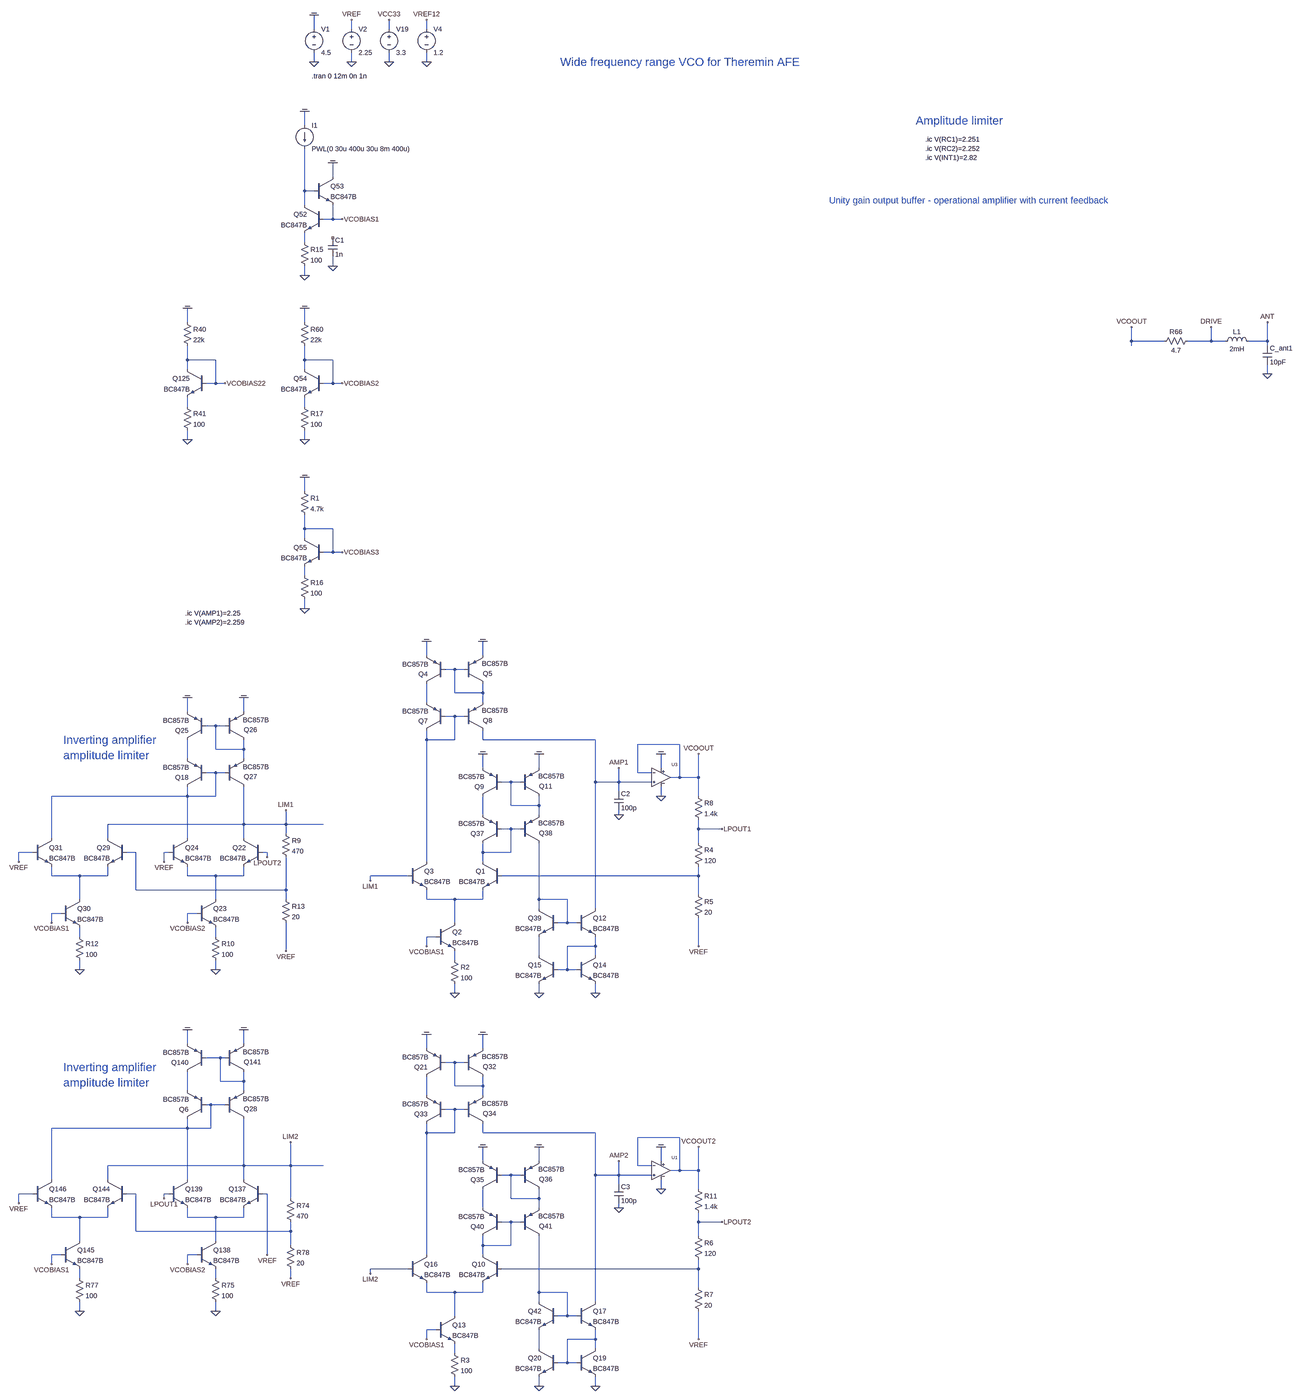
[diagram p0: schematic vco_sine_bjt_v05.asc, whole sheet]
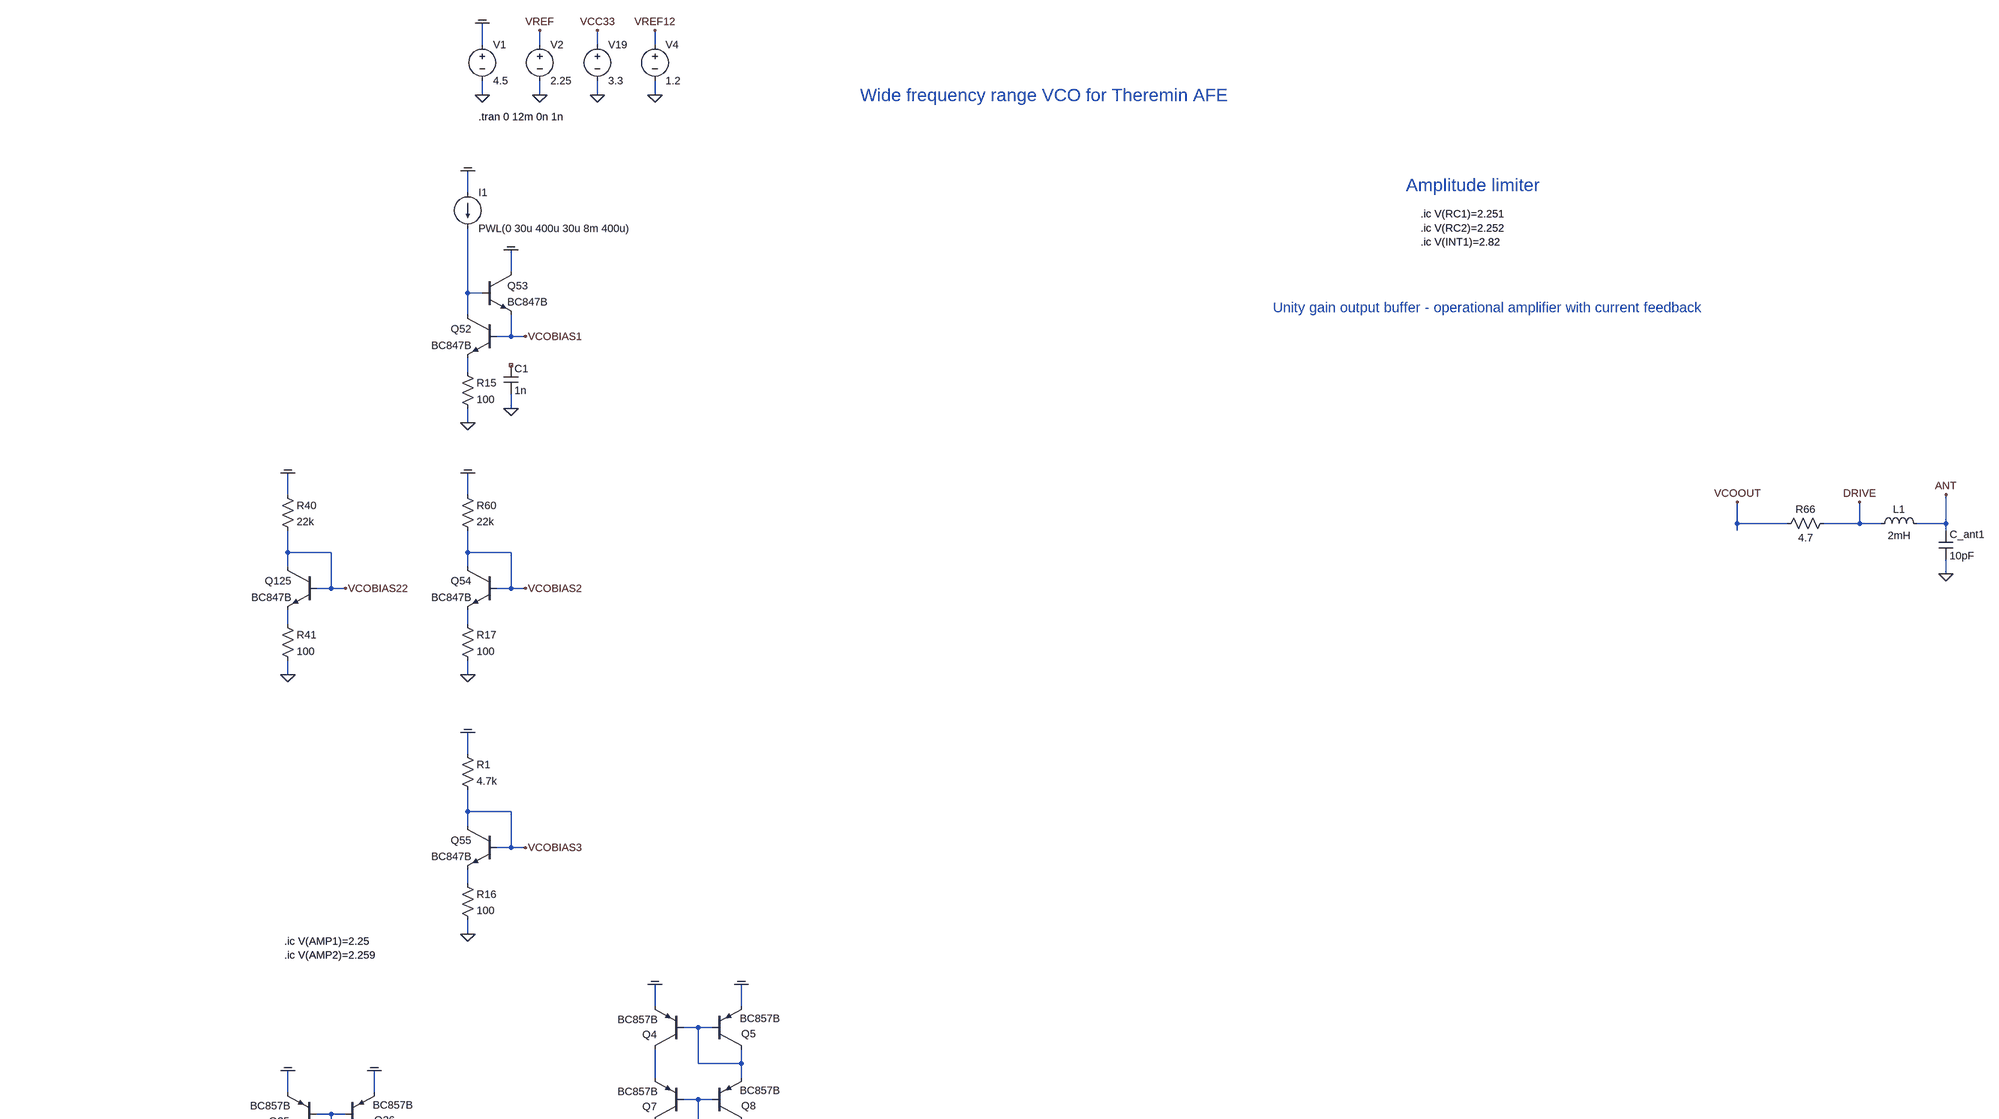
[diagram p1: schematic vco_sine_bjt_v05.asc, part, row 1 of 2, column 1 of 1]
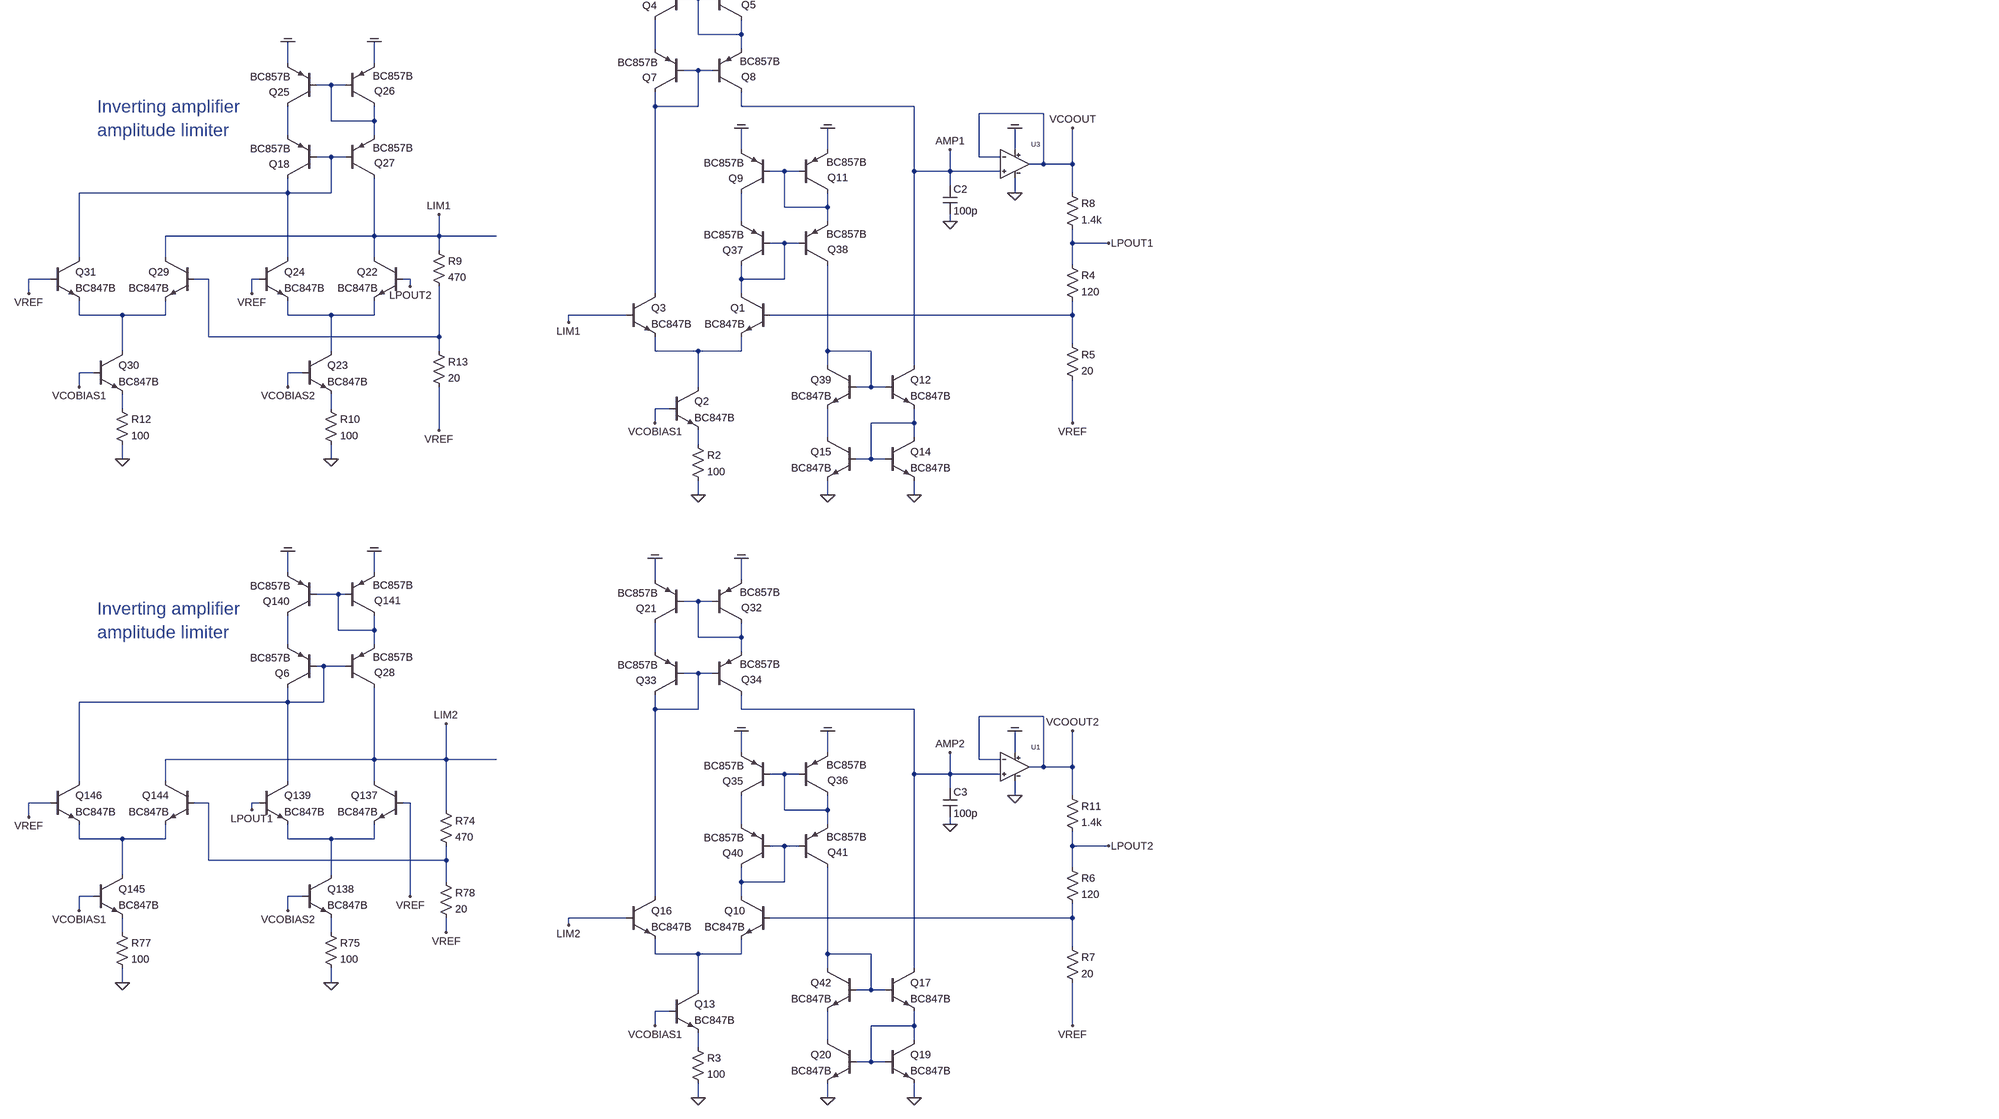
[diagram p2: schematic vco_sine_bjt_v05.asc, part, row 2 of 2, column 1 of 1]
vco_sine_bjt_v05.asc, the LTspice schematic file:
Version 4
SHEET 1 13504 19328
WIRE -432 13600 -432 13552
WIRE -304 13600 -304 13568
WIRE -176 13600 -176 13568
WIRE -48 13600 -48 13568
WIRE -432 13712 -432 13680
WIRE -304 13712 -304 13680
WIRE -176 13712 -176 13680
WIRE -48 13712 -48 13680
WIRE -464 14000 -464 13952
WIRE -368 14176 -368 14128
WIRE -464 14224 -464 14080
WIRE -432 14224 -464 14224
WIRE -464 14272 -464 14224
WIRE -368 14320 -368 14272
WIRE -368 14320 -400 14320
WIRE -336 14320 -368 14320
WIRE -464 14400 -464 14368
WIRE -368 14480 -368 14448
WIRE -464 14512 -464 14480
WIRE -864 14672 -864 14624
WIRE -464 14672 -464 14624
WIRE 3536 14736 3536 14688
WIRE 3648 14736 3536 14736
WIRE 3808 14736 3808 14688
WIRE 3808 14736 3728 14736
WIRE 3856 14736 3808 14736
WIRE 4000 14736 4000 14672
WIRE 4000 14736 3936 14736
WIRE 3536 14752 3536 14736
WIRE 4000 14752 4000 14736
WIRE -864 14800 -864 14752
WIRE -768 14800 -864 14800
WIRE -464 14800 -464 14752
WIRE -368 14800 -464 14800
WIRE -864 14832 -864 14800
WIRE -464 14832 -464 14800
WIRE 4000 14848 4000 14816
WIRE -768 14880 -768 14800
WIRE -768 14880 -800 14880
WIRE -736 14880 -768 14880
WIRE -368 14880 -368 14800
WIRE -368 14880 -400 14880
WIRE -336 14880 -368 14880
WIRE -864 14960 -864 14928
WIRE -464 14960 -464 14928
WIRE -864 15072 -864 15040
WIRE -464 15072 -464 15040
WIRE -464 15280 -464 15232
WIRE -464 15408 -464 15360
WIRE -368 15408 -464 15408
WIRE -464 15440 -464 15408
WIRE -368 15488 -368 15408
WIRE -368 15488 -400 15488
WIRE -336 15488 -368 15488
WIRE -464 15568 -464 15536
WIRE -464 15680 -464 15648
WIRE -48 15840 -48 15792
WIRE 144 15840 144 15792
WIRE 48 15888 16 15888
WIRE 80 15888 48 15888
WIRE 48 15968 48 15888
WIRE 144 15968 144 15936
WIRE 144 15968 48 15968
WIRE -48 16000 -48 15936
WIRE 144 16000 144 15968
WIRE -864 16032 -864 15984
WIRE -672 16032 -672 15984
WIRE 48 16048 16 16048
WIRE 80 16048 48 16048
WIRE -768 16080 -800 16080
WIRE -736 16080 -768 16080
WIRE -48 16128 -48 16096
WIRE 48 16128 48 16048
WIRE 48 16128 -48 16128
WIRE 144 16128 144 16096
WIRE 528 16128 144 16128
WIRE 816 16144 672 16144
WIRE -768 16160 -768 16080
WIRE -672 16160 -672 16128
WIRE -672 16160 -768 16160
WIRE -864 16192 -864 16128
WIRE -672 16192 -672 16160
WIRE 144 16224 144 16176
WIRE 336 16224 336 16176
WIRE 752 16224 752 16176
WIRE -768 16240 -800 16240
WIRE -736 16240 -768 16240
WIRE 672 16240 672 16144
WIRE 720 16240 672 16240
WIRE 816 16256 816 16144
WIRE 816 16256 784 16256
WIRE 880 16256 880 16176
WIRE 880 16256 816 16256
WIRE 240 16272 208 16272
WIRE 272 16272 240 16272
WIRE 528 16272 528 16128
WIRE 608 16272 608 16224
WIRE 608 16272 528 16272
WIRE 720 16272 608 16272
WIRE 608 16304 608 16272
WIRE -864 16320 -864 16288
WIRE -864 16320 -1328 16320
WIRE -768 16320 -768 16240
WIRE -768 16320 -864 16320
WIRE 752 16320 752 16288
WIRE 880 16320 880 16256
WIRE 240 16352 240 16272
WIRE 336 16352 336 16320
WIRE 336 16352 240 16352
WIRE 144 16384 144 16320
WIRE 336 16384 336 16352
WIRE 608 16384 608 16368
WIRE -672 16416 -672 16288
WIRE -672 16416 -1136 16416
WIRE -528 16416 -528 16368
WIRE -528 16416 -672 16416
WIRE -400 16416 -528 16416
WIRE 240 16432 208 16432
WIRE 272 16432 240 16432
WIRE 880 16432 880 16400
WIRE 960 16432 880 16432
WIRE -528 16448 -528 16416
WIRE -1328 16464 -1328 16320
WIRE -1136 16464 -1136 16416
WIRE -864 16464 -864 16320
WIRE -672 16464 -672 16416
WIRE 880 16480 880 16432
WIRE -1392 16512 -1440 16512
WIRE -1040 16512 -1072 16512
WIRE -928 16512 -944 16512
WIRE -592 16512 -608 16512
WIRE 144 16512 144 16480
WIRE 240 16512 240 16432
WIRE 240 16512 144 16512
WIRE -592 16528 -592 16512
WIRE -1440 16544 -1440 16512
WIRE -944 16544 -944 16512
WIRE -48 16544 -48 16128
WIRE 144 16544 144 16512
WIRE -1328 16592 -1328 16560
WIRE -1232 16592 -1328 16592
WIRE -1136 16592 -1136 16560
WIRE -1136 16592 -1232 16592
WIRE -864 16592 -864 16560
WIRE -768 16592 -864 16592
WIRE -672 16592 -672 16560
WIRE -672 16592 -768 16592
WIRE -112 16592 -240 16592
WIRE 880 16592 880 16560
WIRE 880 16592 208 16592
WIRE -240 16608 -240 16592
WIRE -1040 16640 -1040 16512
WIRE -528 16640 -528 16528
WIRE -528 16640 -1040 16640
WIRE 880 16656 880 16592
WIRE -1232 16672 -1232 16592
WIRE -768 16672 -768 16592
WIRE -528 16672 -528 16640
WIRE -48 16672 -48 16640
WIRE 48 16672 -48 16672
WIRE 144 16672 144 16640
WIRE 144 16672 48 16672
WIRE 336 16672 336 16480
WIRE 432 16672 336 16672
WIRE 336 16704 336 16672
WIRE 528 16704 528 16272
WIRE -1296 16720 -1328 16720
WIRE -832 16720 -864 16720
WIRE -1328 16752 -1328 16720
WIRE -864 16752 -864 16720
WIRE 48 16752 48 16672
WIRE 432 16752 432 16672
WIRE 432 16752 400 16752
WIRE 464 16752 432 16752
WIRE -1232 16800 -1232 16768
WIRE -768 16800 -768 16768
WIRE -16 16800 -48 16800
WIRE -48 16832 -48 16800
WIRE 528 16832 528 16800
WIRE 528 16832 432 16832
WIRE 880 16832 880 16736
WIRE -528 16848 -528 16752
WIRE 336 16864 336 16800
WIRE 528 16864 528 16832
WIRE 48 16880 48 16848
WIRE -1232 16912 -1232 16880
WIRE -768 16912 -768 16880
WIRE 432 16912 432 16832
WIRE 432 16912 400 16912
WIRE 464 16912 432 16912
WIRE 48 16992 48 16960
WIRE 336 16992 336 16960
WIRE 528 16992 528 16960
WIRE -864 17248 -864 17200
WIRE -672 17248 -672 17200
WIRE -48 17264 -48 17216
WIRE 144 17264 144 17216
WIRE -752 17296 -800 17296
WIRE -736 17296 -752 17296
WIRE 48 17312 16 17312
WIRE 80 17312 48 17312
WIRE -752 17376 -752 17296
WIRE -672 17376 -672 17344
WIRE -672 17376 -752 17376
WIRE 48 17392 48 17312
WIRE 144 17392 144 17360
WIRE 144 17392 48 17392
WIRE -864 17408 -864 17344
WIRE -672 17408 -672 17376
WIRE -48 17424 -48 17360
WIRE 144 17424 144 17392
WIRE -784 17456 -800 17456
WIRE -736 17456 -784 17456
WIRE 48 17472 16 17472
WIRE 80 17472 48 17472
WIRE -864 17536 -864 17504
WIRE -864 17536 -1328 17536
WIRE -784 17536 -784 17456
WIRE -784 17536 -864 17536
WIRE -48 17552 -48 17520
WIRE 48 17552 48 17472
WIRE 48 17552 -48 17552
WIRE 144 17552 144 17520
WIRE 528 17552 144 17552
WIRE 816 17568 672 17568
WIRE 144 17648 144 17600
WIRE 336 17648 336 17600
WIRE 752 17648 752 17600
WIRE -672 17664 -672 17504
WIRE -672 17664 -1136 17664
WIRE -512 17664 -512 17584
WIRE -512 17664 -672 17664
WIRE -400 17664 -512 17664
WIRE 672 17664 672 17568
WIRE 720 17664 672 17664
WIRE 816 17680 816 17568
WIRE 816 17680 784 17680
WIRE 880 17680 880 17600
WIRE 880 17680 816 17680
WIRE 240 17696 208 17696
WIRE 272 17696 240 17696
WIRE 528 17696 528 17552
WIRE 608 17696 608 17648
WIRE 608 17696 528 17696
WIRE 720 17696 608 17696
WIRE -1328 17712 -1328 17536
WIRE -1136 17712 -1136 17664
WIRE -864 17712 -864 17536
WIRE -672 17712 -672 17664
WIRE 608 17728 608 17696
WIRE 752 17744 752 17712
WIRE 880 17744 880 17680
WIRE -1392 17760 -1440 17760
WIRE -1040 17760 -1072 17760
WIRE -928 17760 -944 17760
WIRE -592 17760 -608 17760
WIRE -944 17776 -944 17760
WIRE -512 17776 -512 17664
WIRE 240 17776 240 17696
WIRE 336 17776 336 17744
WIRE 336 17776 240 17776
WIRE -1440 17792 -1440 17760
WIRE 144 17808 144 17744
WIRE 336 17808 336 17776
WIRE 608 17808 608 17792
WIRE -1328 17840 -1328 17808
WIRE -1232 17840 -1328 17840
WIRE -1136 17840 -1136 17808
WIRE -1136 17840 -1232 17840
WIRE -864 17840 -864 17808
WIRE -768 17840 -864 17840
WIRE -672 17840 -672 17808
WIRE -672 17840 -768 17840
WIRE 240 17856 208 17856
WIRE 272 17856 240 17856
WIRE 880 17856 880 17824
WIRE 960 17856 880 17856
WIRE -1040 17888 -1040 17760
WIRE -512 17888 -512 17856
WIRE -512 17888 -1040 17888
WIRE 880 17904 880 17856
WIRE -1232 17920 -1232 17840
WIRE -768 17920 -768 17840
WIRE -512 17936 -512 17888
WIRE 144 17936 144 17904
WIRE 240 17936 240 17856
WIRE 240 17936 144 17936
WIRE -1296 17968 -1328 17968
WIRE -832 17968 -864 17968
WIRE -592 17968 -592 17760
WIRE -48 17968 -48 17552
WIRE 144 17968 144 17936
WIRE -1328 18000 -1328 17968
WIRE -864 18000 -864 17968
WIRE -112 18016 -240 18016
WIRE 880 18016 880 17984
WIRE 880 18016 208 18016
WIRE -240 18032 -240 18016
WIRE -1232 18048 -1232 18016
WIRE -768 18048 -768 18016
WIRE -512 18048 -512 18016
WIRE 880 18080 880 18016
WIRE -48 18096 -48 18064
WIRE 48 18096 -48 18096
WIRE 144 18096 144 18064
WIRE 144 18096 48 18096
WIRE 336 18096 336 17904
WIRE 432 18096 336 18096
WIRE 336 18128 336 18096
WIRE 528 18128 528 17696
WIRE -1232 18160 -1232 18128
WIRE -768 18160 -768 18128
WIRE 48 18176 48 18096
WIRE 432 18176 432 18096
WIRE 432 18176 400 18176
WIRE 464 18176 432 18176
WIRE -16 18224 -48 18224
WIRE -48 18256 -48 18224
WIRE 528 18256 528 18224
WIRE 528 18256 432 18256
WIRE 880 18256 880 18160
WIRE 336 18288 336 18224
WIRE 528 18288 528 18256
WIRE 48 18304 48 18272
WIRE 432 18336 432 18256
WIRE 432 18336 400 18336
WIRE 464 18336 432 18336
WIRE 48 18416 48 18384
WIRE 336 18416 336 18384
WIRE 528 18416 528 18384
FLAG -432 13712 0
FLAG -432 13552 COM
FLAG -304 13712 0
FLAG -304 13568 VREF
FLAG -176 13712 0
FLAG -176 13568 VCC33
FLAG -48 13712 0
FLAG -48 13568 VREF12
FLAG -336 14320 VCOBIAS1
FLAG -464 14624 COM
FLAG -464 15232 COM
FLAG -464 13952 COM
FLAG -336 14880 VCOBIAS2
FLAG -336 15488 VCOBIAS3
FLAG -368 14128 COM
FLAG -464 14512 0
FLAG -464 15680 0
FLAG -464 15072 0
FLAG -368 14480 0
FLAG -864 14624 COM
FLAG -736 14880 VCOBIAS22
FLAG -864 15072 0
FLAG 4000 14848 0
FLAG 4000 14672 ANT
FLAG 3808 14688 DRIVE
FLAG 3536 14688 VCOOUT
FLAG -864 18000 VCOBIAS2
FLAG -512 18048 VREF
FLAG -512 17584 LIM2
FLAG -768 18160 0
FLAG -864 17200 COM
FLAG -672 17200 COM
FLAG -1328 18000 VCOBIAS1
FLAG -1232 18160 0
FLAG -48 16832 VCOBIAS1
FLAG 48 16992 0
FLAG 336 16992 0
FLAG 528 16992 0
FLAG 608 16384 0
FLAG 608 16224 AMP1
FLAG -240 16608 LIM1
FLAG 880 16832 VREF
FLAG 880 16176 VCOOUT
FLAG -864 16752 VCOBIAS2
FLAG -528 16848 VREF
FLAG -528 16368 LIM1
FLAG -768 16912 0
FLAG -944 16544 VREF
FLAG -864 15984 COM
FLAG -672 15984 COM
FLAG -1328 16752 VCOBIAS1
FLAG -1232 16912 0
FLAG -592 16528 LPOUT2
FLAG -944 17776 LPOUT1
FLAG -1440 16544 VREF
FLAG -1440 17792 VREF
FLAG -592 17968 VREF
FLAG 752 16320 0
FLAG 752 16176 COM
FLAG 960 16432 LPOUT1
FLAG -48 15792 COM
FLAG 144 15792 COM
FLAG 144 16176 COM
FLAG 336 16176 COM
FLAG -48 18256 VCOBIAS1
FLAG 48 18416 0
FLAG 336 18416 0
FLAG 528 18416 0
FLAG 608 17808 0
FLAG 608 17648 AMP2
FLAG -240 18032 LIM2
FLAG 880 18256 VREF
FLAG 880 17600 VCOOUT2
FLAG 752 17744 0
FLAG 752 17600 COM
FLAG 960 17856 LPOUT2
FLAG -48 17216 COM
FLAG 144 17216 COM
FLAG 144 17600 COM
FLAG 336 17600 COM
SYMBOL voltage -432 13584 R0
SYMATTR InstName V1
SYMATTR Value 4.5
SYMBOL Voltage -304 13584 R0
SYMATTR InstName V2
SYMATTR Value 2.25
SYMBOL Voltage -176 13584 R0
SYMATTR InstName V19
SYMATTR Value 3.3
SYMBOL Voltage -48 13584 R0
SYMATTR InstName V4
SYMATTR Value 1.2
SYMBOL npn -400 14272 M0
SYMATTR InstName Q52
SYMATTR Value BC847B
SYMBOL Res -480 14656 R0
SYMATTR InstName R60
SYMATTR Value 22k
SYMBOL Res -480 15264 R0
SYMATTR InstName R1
SYMATTR Value 4.7k
SYMBOL current -464 14000 R0
SYMATTR InstName I1
SYMATTR Value PWL(0 30u 400u 30u 8m 400u)
SYMBOL npn -400 14832 M0
SYMATTR InstName Q54
SYMATTR Value BC847B
SYMBOL npn -400 15440 M0
SYMATTR InstName Q55
SYMATTR Value BC847B
SYMBOL npn -432 14176 R0
SYMATTR InstName Q53
SYMATTR Value BC847B
SYMBOL Res -480 14384 R0
SYMATTR InstName R15
SYMATTR Value 100
SYMBOL Res -480 15552 R0
SYMATTR InstName R16
SYMATTR Value 100
SYMBOL Res -480 14944 R0
SYMATTR InstName R17
SYMATTR Value 100
SYMBOL Cap -384 14384 R0
SYMATTR InstName C1
SYMATTR Value 1n
SYMBOL Res -880 14656 R0
SYMATTR InstName R40
SYMATTR Value 22k
SYMBOL npn -800 14832 M0
SYMATTR InstName Q125
SYMATTR Value BC847B
SYMBOL Res -880 14944 R0
SYMATTR InstName R41
SYMATTR Value 100
SYMBOL ind 3840 14752 R270
WINDOW 0 32 56 VTop 2
WINDOW 3 5 56 VBottom 2
SYMATTR InstName L1
SYMATTR Value 2mH
SYMATTR SpiceLine Rser=120 Cpar=1pF
SYMBOL Cap 3984 14752 R0
SYMATTR InstName C_ant1
SYMATTR Value 10pF
SYMBOL Res 3632 14752 R270
WINDOW 0 32 56 VTop 2
WINDOW 3 0 56 VBottom 2
SYMATTR InstName R66
SYMATTR Value 4.7
SYMBOL npn -608 17712 M0
SYMATTR InstName Q137
SYMATTR Value BC847B
SYMBOL npn -832 17920 R0
SYMATTR InstName Q138
SYMATTR Value BC847B
SYMBOL npn -928 17712 R0
SYMATTR InstName Q139
SYMATTR Value BC847B
SYMBOL Res -528 17760 R0
SYMATTR InstName R74
SYMATTR Value 470
SYMBOL Res -784 18032 R0
SYMATTR InstName R75
SYMATTR Value 100
SYMBOL pnp -800 17344 R180
WINDOW 0 60 32 Left 2
WINDOW 3 58 66 Left 2
SYMATTR InstName Q140
SYMATTR Value BC857B
SYMBOL pnp -736 17344 M180
WINDOW 0 64 34 Left 2
WINDOW 3 61 68 Left 2
SYMATTR InstName Q141
SYMATTR Value BC857B
SYMBOL npn -1072 17712 M0
SYMATTR InstName Q144
SYMATTR Value BC847B
SYMBOL npn -1296 17920 R0
SYMATTR InstName Q145
SYMATTR Value BC847B
SYMBOL npn -1392 17712 R0
SYMATTR InstName Q146
SYMATTR Value BC847B
SYMBOL Res -1248 18032 R0
SYMATTR InstName R77
SYMATTR Value 100
SYMBOL Res -528 17920 R0
SYMATTR InstName R78
SYMATTR Value 20
SYMBOL npn 208 16544 M0
SYMATTR InstName Q1
SYMATTR Value BC847B
SYMBOL npn -16 16752 R0
SYMATTR InstName Q2
SYMATTR Value BC847B
SYMBOL npn -112 16544 R0
SYMATTR InstName Q3
SYMATTR Value BC847B
SYMBOL Res 32 16864 R0
SYMATTR InstName R2
SYMATTR Value 100
SYMBOL npn 464 16704 R0
SYMATTR InstName Q12
SYMATTR Value BC847B
SYMBOL npn 464 16864 R0
SYMATTR InstName Q14
SYMATTR Value BC847B
SYMBOL npn 400 16864 M0
SYMATTR InstName Q15
SYMATTR Value BC847B
SYMBOL Cap 592 16304 R0
SYMATTR InstName C2
SYMATTR Value 100p
SYMBOL Res 864 16464 R0
SYMATTR InstName R4
SYMATTR Value 120
SYMBOL Res 864 16640 R0
SYMATTR InstName R5
SYMATTR Value 20
SYMBOL npn -608 16464 M0
SYMATTR InstName Q22
SYMATTR Value BC847B
SYMBOL npn -832 16672 R0
SYMATTR InstName Q23
SYMATTR Value BC847B
SYMBOL npn -928 16464 R0
SYMATTR InstName Q24
SYMATTR Value BC847B
SYMBOL Res -544 16432 R0
SYMATTR InstName R9
SYMATTR Value 470
SYMBOL Res -784 16784 R0
SYMATTR InstName R10
SYMATTR Value 100
SYMBOL pnp -800 16128 R180
WINDOW 0 60 32 Left 2
WINDOW 3 58 66 Left 2
SYMATTR InstName Q25
SYMATTR Value BC857B
SYMBOL pnp -736 16128 M180
WINDOW 0 64 34 Left 2
WINDOW 3 61 68 Left 2
SYMATTR InstName Q26
SYMATTR Value BC857B
SYMBOL npn -1072 16464 M0
SYMATTR InstName Q29
SYMATTR Value BC847B
SYMBOL npn -1296 16672 R0
SYMATTR InstName Q30
SYMATTR Value BC847B
SYMBOL npn -1392 16464 R0
SYMATTR InstName Q31
SYMATTR Value BC847B
SYMBOL Res -1248 16784 R0
SYMATTR InstName R12
SYMATTR Value 100
SYMBOL Res -544 16656 R0
SYMATTR InstName R13
SYMATTR Value 20
SYMBOL MCP6021 752 16256 R0
SYMATTR InstName U3
SYMBOL pnp -800 16288 R180
WINDOW 0 60 32 Left 2
WINDOW 3 58 66 Left 2
SYMATTR InstName Q18
SYMATTR Value BC857B
SYMBOL pnp -736 16288 M180
WINDOW 0 64 34 Left 2
WINDOW 3 61 68 Left 2
SYMATTR InstName Q27
SYMATTR Value BC857B
SYMBOL pnp -800 17504 R180
WINDOW 0 60 32 Left 2
WINDOW 3 58 66 Left 2
SYMATTR InstName Q6
SYMATTR Value BC857B
SYMBOL pnp -736 17504 M180
WINDOW 0 64 34 Left 2
WINDOW 3 61 68 Left 2
SYMATTR InstName Q28
SYMATTR Value BC857B
SYMBOL Res 864 16304 R0
SYMATTR InstName R8
SYMATTR Value 1.4k
SYMBOL pnp 16 15936 R180
WINDOW 0 60 32 Left 2
WINDOW 3 58 66 Left 2
SYMATTR InstName Q4
SYMATTR Value BC857B
SYMBOL pnp 80 15936 M180
WINDOW 0 64 34 Left 2
WINDOW 3 61 68 Left 2
SYMATTR InstName Q5
SYMATTR Value BC857B
SYMBOL pnp 16 16096 R180
WINDOW 0 60 32 Left 2
WINDOW 3 58 66 Left 2
SYMATTR InstName Q7
SYMATTR Value BC857B
SYMBOL pnp 80 16096 M180
WINDOW 0 64 34 Left 2
WINDOW 3 61 68 Left 2
SYMATTR InstName Q8
SYMATTR Value BC857B
SYMBOL pnp 208 16320 R180
WINDOW 0 60 32 Left 2
WINDOW 3 58 66 Left 2
SYMATTR InstName Q9
SYMATTR Value BC857B
SYMBOL pnp 272 16320 M180
WINDOW 0 64 34 Left 2
WINDOW 3 61 68 Left 2
SYMATTR InstName Q11
SYMATTR Value BC857B
SYMBOL pnp 208 16480 R180
WINDOW 0 60 32 Left 2
WINDOW 3 58 66 Left 2
SYMATTR InstName Q37
SYMATTR Value BC857B
SYMBOL pnp 272 16480 M180
WINDOW 0 64 34 Left 2
WINDOW 3 61 68 Left 2
SYMATTR InstName Q38
SYMATTR Value BC857B
SYMBOL npn 400 16704 M0
SYMATTR InstName Q39
SYMATTR Value BC847B
SYMBOL npn 208 17968 M0
SYMATTR InstName Q10
SYMATTR Value BC847B
SYMBOL npn -16 18176 R0
SYMATTR InstName Q13
SYMATTR Value BC847B
SYMBOL npn -112 17968 R0
SYMATTR InstName Q16
SYMATTR Value BC847B
SYMBOL Res 32 18288 R0
SYMATTR InstName R3
SYMATTR Value 100
SYMBOL npn 464 18128 R0
SYMATTR InstName Q17
SYMATTR Value BC847B
SYMBOL npn 464 18288 R0
SYMATTR InstName Q19
SYMATTR Value BC847B
SYMBOL npn 400 18288 M0
SYMATTR InstName Q20
SYMATTR Value BC847B
SYMBOL Cap 592 17728 R0
SYMATTR InstName C3
SYMATTR Value 100p
SYMBOL Res 864 17888 R0
SYMATTR InstName R6
SYMATTR Value 120
SYMBOL Res 864 18064 R0
SYMATTR InstName R7
SYMATTR Value 20
SYMBOL MCP6021 752 17680 R0
SYMATTR InstName U1
SYMBOL Res 864 17728 R0
SYMATTR InstName R11
SYMATTR Value 1.4k
SYMBOL pnp 16 17360 R180
WINDOW 0 60 32 Left 2
WINDOW 3 58 66 Left 2
SYMATTR InstName Q21
SYMATTR Value BC857B
SYMBOL pnp 80 17360 M180
WINDOW 0 64 34 Left 2
WINDOW 3 61 68 Left 2
SYMATTR InstName Q32
SYMATTR Value BC857B
SYMBOL pnp 16 17520 R180
WINDOW 0 60 32 Left 2
WINDOW 3 58 66 Left 2
SYMATTR InstName Q33
SYMATTR Value BC857B
SYMBOL pnp 80 17520 M180
WINDOW 0 64 34 Left 2
WINDOW 3 61 68 Left 2
SYMATTR InstName Q34
SYMATTR Value BC857B
SYMBOL pnp 208 17744 R180
WINDOW 0 60 32 Left 2
WINDOW 3 58 66 Left 2
SYMATTR InstName Q35
SYMATTR Value BC857B
SYMBOL pnp 272 17744 M180
WINDOW 0 64 34 Left 2
WINDOW 3 61 68 Left 2
SYMATTR InstName Q36
SYMATTR Value BC857B
SYMBOL pnp 208 17904 R180
WINDOW 0 60 32 Left 2
WINDOW 3 58 66 Left 2
SYMATTR InstName Q40
SYMATTR Value BC857B
SYMBOL pnp 272 17904 M180
WINDOW 0 64 34 Left 2
WINDOW 3 61 68 Left 2
SYMATTR InstName Q41
SYMATTR Value BC857B
SYMBOL npn 400 18128 M0
SYMATTR InstName Q42
SYMATTR Value BC847B
TEXT -440 13760 Left 2 !.tran 0 12m 0n 1n
TEXT 408 13712 Left 4 ;Wide frequency range VCO for Theremin AFE
TEXT 2832 14048 Left 2 !.ic V(RC1)=2.251\n.ic V(RC2)=2.252\n.ic V(INT1)=2.82
TEXT 2800 13984 Left 4 ;Amplitude limiter
TEXT 2504 14256 Left 3 ;Unity gain output buffer - operational amplifier with current feedback
TEXT -872 15696 Left 2 !.ic V(AMP1)=2.25\n.ic V(AMP2)=2.259
TEXT -1288 17328 Left 4 ;Inverting amplifier\namplitude limiter
TEXT -1288 16128 Left 4 ;Inverting amplifier\namplitude limiter

The netlist it stands for:
* vco_sine_bjt_v05.asc
V1 COM 0 4.5
V2 VREF 0 2.25
V19 VCC33 0 3.3
V4 VREF12 0 1.2
Q52 N001 VCOBIAS1 N002 0 BC847B
R60 COM VCOBIAS2 22k
R1 COM VCOBIAS3 4.7k
I1 COM N001 PWL(0 30u 400u 30u 8m 400u)
Q54 VCOBIAS2 VCOBIAS2 N004 0 BC847B
Q55 VCOBIAS3 VCOBIAS3 N005 0 BC847B
Q53 COM N001 VCOBIAS1 0 BC847B
R15 N002 0 100
R16 N005 0 100
R17 N004 0 100
C1 NC_01 0 1n
R40 COM VCOBIAS22 22k
Q125 VCOBIAS22 VCOBIAS22 N003 0 BC847B
R41 N003 0 100
L1 DRIVE ANT 2mH Rser=120 Cpar=1pF
C_ant1 ANT 0 10pF
R66 VCOOUT DRIVE 4.7
Q137 LIM2 VREF N036 0 BC847B
Q138 N036 VCOBIAS2 N040 0 BC847B
Q139 N030 LPOUT1 N036 0 BC847B
R74 LIM2 N033 470
R75 N040 0 100
Q140 N028 N026 COM 0 BC857B
Q141 N026 N026 COM 0 BC857B
Q144 LIM2 N033 N035 0 BC847B
Q145 N035 VCOBIAS1 N039 0 BC847B
Q146 N030 VREF N035 0 BC847B
R77 N039 0 100
R78 N033 VREF 20
Q1 N014 N018 N019 0 BC847B
Q2 N019 VCOBIAS1 N025 0 BC847B
Q3 N008 LIM1 N019 0 BC847B
R2 N025 0 100
Q12 AMP1 N020 N023 0 BC847B
Q14 N023 N023 0 0 BC847B
Q15 N024 N023 0 0 BC847B
C2 AMP1 0 100p
R4 LPOUT1 N018 120
R5 N018 VREF 20
Q22 LIM1 LPOUT2 N017 0 BC847B
Q23 N017 VCOBIAS2 N022 0 BC847B
Q24 N011 VREF N017 0 BC847B
R9 LIM1 N015 470
R10 N022 0 100
Q25 N010 N009 COM 0 BC857B
Q26 N009 N009 COM 0 BC857B
Q29 LIM1 N015 N016 0 BC847B
Q30 N016 VCOBIAS1 N021 0 BC847B
Q31 N011 VREF N016 0 BC847B
R12 N021 0 100
R13 N015 VREF 20
XU3 AMP1 VCOOUT COM 0 VCOOUT MCP6021  ; pins In+ In- V+ V- OUT
Q18 N011 N011 N010 0 BC857B
Q27 LIM1 N011 N009 0 BC857B
Q6 N030 N030 N028 0 BC857B
Q28 LIM2 N030 N026 0 BC857B
R8 VCOOUT LPOUT1 1.4k
Q4 N007 N006 COM 0 BC857B
Q5 N006 N006 COM 0 BC857B
Q7 N008 N008 N007 0 BC857B
Q8 AMP1 N008 N006 0 BC857B
Q9 N013 N012 COM 0 BC857B
Q11 N012 N012 COM 0 BC857B
Q37 N014 N014 N013 0 BC857B
Q38 N020 N014 N012 0 BC857B
Q39 N020 N020 N024 0 BC847B
Q10 N037 N038 N041 0 BC847B
Q13 N041 VCOBIAS1 N045 0 BC847B
Q16 N031 LIM2 N041 0 BC847B
R3 N045 0 100
Q17 AMP2 N042 N043 0 BC847B
Q19 N043 N043 0 0 BC847B
Q20 N044 N043 0 0 BC847B
C3 AMP2 0 100p
R6 LPOUT2 N038 120
R7 N038 VREF 20
XU1 AMP2 VCOOUT2 COM 0 VCOOUT2 MCP6021  ; pins In+ In- V+ V- OUT
R11 VCOOUT2 LPOUT2 1.4k
Q21 N029 N027 COM 0 BC857B
Q32 N027 N027 COM 0 BC857B
Q33 N031 N031 N029 0 BC857B
Q34 AMP2 N031 N027 0 BC857B
Q35 N034 N032 COM 0 BC857B
Q36 N032 N032 COM 0 BC857B
Q40 N037 N037 N034 0 BC857B
Q41 N042 N037 N032 0 BC857B
Q42 N042 N042 N044 0 BC847B
.model NPN NPN
.model PNP PNP
.lib standard.bjt
.tran 0 12m 0n 1n
* Wide frequency range VCO for Theremin AFE
.ic V(RC1)=2.251
.ic V(RC2)=2.252
.ic V(INT1)=2.82
* Amplitude limiter
* Unity gain output buffer - operational amplifier with current feedback
.ic V(AMP1)=2.25
.ic V(AMP2)=2.259
* Inverting amplifier
* amplitude limiter
* Inverting amplifier
* amplitude limiter
.lib MCP6021.cir
.backanno
.end